# Altium schematic sheet tia.SchDoc: DiPho AFE
size 420 x 297 mm; Author: P. Daniel; DrawnBy: P. Daniel; Address1: WUT ISE; Address2: WUT ISE; Address3: piotrmaciejdaniel@gmail.com; SheetNumber: 2; SheetTotal: 4; ModifiedBy: -; CreateDate: 10-12.2021; CheckedDate: -; Title2: PG TIA schematic; Designer: Piotr Daniel
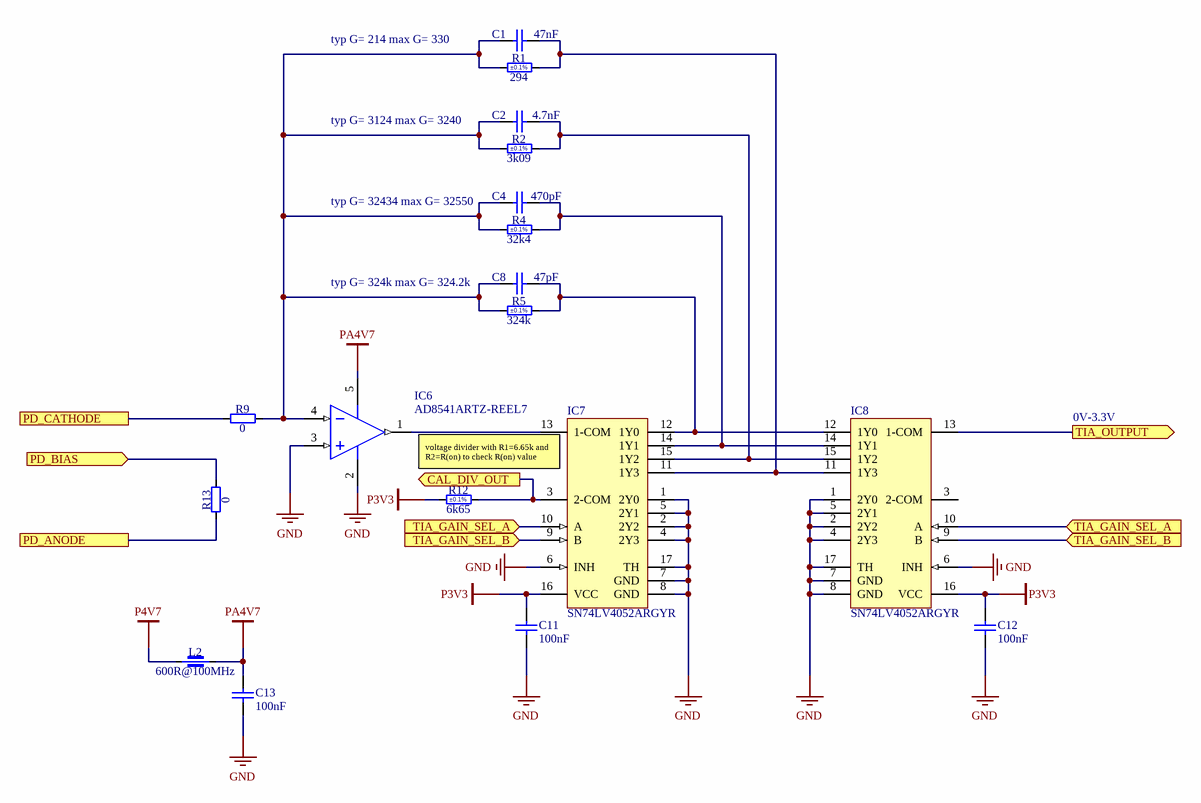
[diagram p0: tia.SchDoc]

## Parts
C1  47nF  [CAPC1005X55N]
C2  4.7nF  [CAPC1005X55N]
C4  470pF  [CAPC1005X55N]
C8  47pF  [CAPC1005X55N]
C11  100nF  [CAPC1005X55N]
C12  100nF  [CAPC1005X55N]
C13  100nF  [CAPC1005X55N]
IC6  AD8541ARTZ-REEL7  [ADI-RJ-5_N]
IC7  SN74LV4052ARGYR  [FP-RGY0016A-MFG]
IC8  SN74LV4052ARGYR  [FP-RGY0016A-MFG]
L2  600R@100MHz  [INDC1005X55N]
R1  294  Tolerance: ±0.1%  [RESC1005X40N]
R2  3k09  Tolerance: ±0.1%  [RESC1005X40N]
R4  32k4  Tolerance: ±0.1%  [RESC1005X40N]
R5  324k  Tolerance: ±0.1%  [RESC1005X40N]
R9  0  [RESC1005X40N]
R12  6k65  Tolerance: ±0.1%  [RESC1005X40N]
R13  0  [RESC1005X40N]

## Ports
CAL_DIV_OUT (out), PD_ANODE, PD_BIAS (in), PD_CATHODE, TIA_GAIN_SEL_A (in), TIA_GAIN_SEL_B (in), TIA_OUTPUT (out)

## Nets
GND: C11.1 C12.1 C13.1 IC6.2(-V) IC6.3(+IN_A) IC7.1(2Y0) IC7.2(2Y2) IC7.4(2Y3) IC7.5(2Y1) IC7.6(INH) IC7.7(GND) IC7.8(GND) IC7.17(TH) IC8.1(2Y0) IC8.2(2Y2) IC8.4(2Y3) IC8.5(2Y1) IC8.6(INH) IC8.7(GND) IC8.8(GND) IC8.17(TH)
P3V3: C11.2 C12.2 IC7.16(VCC) IC8.16(VCC) R12.1
P4V7: L2.1
PA4V7: C13.2 IC6.5(+V) L2.2
CAL_DIV_OUT: IC7.3(2-COM) R12.2 ; port CAL_DIV_OUT
PD_ANODE: R13.1 ; port PD_ANODE
PD_BIAS: R13.2 ; port PD_BIAS
PD_CATHODE: R9.1 ; port PD_CATHODE
TIA_GAIN_SEL_A: IC7.10(A) IC8.10(A) ; port TIA_GAIN_SEL_A
TIA_GAIN_SEL_B: IC7.9(B) IC8.9(B) ; port TIA_GAIN_SEL_B
TIA_OUTPUT: IC8.13(1-COM) ; port TIA_OUTPUT
NetC1_1: C1.1 C2.1 C4.1 C8.1 IC6.4(-IN_A) R1.1 R2.1 R4.1 R5.1 R9.2
NetC1_2: C1.2 IC7.11(1Y3) IC8.11(1Y3) R1.2
NetC2_2: C2.2 IC7.15(1Y2) IC8.15(1Y2) R2.2
NetC4_2: C4.2 IC7.14(1Y1) IC8.14(1Y1) R4.2
NetC8_2: C8.2 IC7.12(1Y0) IC8.12(1Y0) R5.2
NetIC6_1: IC6.1(OUT_A) IC7.13(1-COM)

Not connected (* = marked no-connect by the designer): IC8 3(2-COM)

## Notes on the sheet
- typ G= 214 max G= 330
- typ G= 3124 max G= 3240
- typ G= 32434 max G= 32550
- typ G= 324k max G= 324.2k
- 0V-3.3V
- (near IC7) voltage divider with R1=6.65k and R2=R(on) to check R(on) value
- Project/Equipment
- Document
- Designer
- Drawn by
- Check.by
- Copyright WUT ISE 2021.
  This documentation describes Open Hardware and is licensed under the CERN OHL v.1.1. You may redistribute and modify this documentation under the terms of the CERN OHL v.1.1. (http://ohwr.org/CERNOHL). This documentation is distributed WITHOUT ANY EXPRESS OR IMPLIED WARRANTY, INCLUDING OF MERCHANTABILITY, SATISFACTORY QUALITY AND FITNESS FOR A PARTICULAR PURPOSE. Please see the CERN OHL v.1.1 for applicable conditions.
- Contact
- File
- Last Mod.
- Print Date
- Sheet
- Size
- A3
- of
- Rev

## Library data of the parts
C1 = CC0402_47NF_16V_10%_X7R: Non-polarised capacitor; Part Description: SMD Multilayer Chip Ceramic Capacitor; Manufacturer: GENERIC; Manufacturer1 Part Number: 223878715645; Voltage: 16V; TC: X7R; Tolerance: ±10%; Part Number: CC0402_47NF_16V_10%_X7R; Component Kind: Standard; Component Type: Standard; Pin Count: 2; Value: 47nF; Status: Not Recommended; Manufacturer Part Number: CC0402_47NF_16V_10%_X7R; Case: 0402; Mounted: Yes; Socket: No; SMD: Yes; Sense: No; Manufacturer1 Example: PHYCOMP; Manufacturer1 ComponentHeight: 0.55mm; HelpURL: \\cern.ch\dfs\Applications\Altium\Datasheets\CC0402_X7R_PHYCOMP.pdf; Author: CERN DEM JLC; CreateDate: 03.12.2007; LatestRevisionDate: 03.12.2007
C2 = CC0402_4.7NF_16V_10%_X7R: Non-polarised capacitor; Part Description: SMD Multilayer Chip Ceramic Capacitor; Manufacturer: GENERIC; Manufacturer1 Part Number: 223878715632; Voltage: 16V; TC: X7R; Tolerance: ±10%; Part Number: CC0402_4.7NF_16V_10%_X7R; Component Kind: Standard; Component Type: Standard; Pin Count: 2; Value: 4.7nF; Status: Not Recommended; Manufacturer Part Number: CC0402_4.7NF_16V_10%_X7R; Case: 0402; Mounted: Yes; Socket: No; SMD: Yes; Sense: No; Manufacturer1 Example: PHYCOMP; Manufacturer1 ComponentHeight: 0.55mm; HelpURL: \\cern.ch\dfs\Applications\Altium\Datasheets\CC0402_X7R_PHYCOMP.pdf; Author: CERN DEM JLC; CreateDate: 03.12.2007; LatestRevisionDate: 03.12.2007
C4 = CC0402_470PF_50V_10%_X7R: Non-polarised capacitor; Part Description: SMD Multilayer Chip Ceramic Capacitor; Manufacturer: GENERIC; Manufacturer1 Part Number: 223858715618; Voltage: 50V; TC: X7R; Tolerance: ±10%; Part Number: CC0402_470PF_50V_10%_X7R; Component Kind: Standard; Component Type: Standard; Pin Count: 2; Value: 470pF; Status: Not Recommended; Manufacturer Part Number: CC0402_470PF_50V_10%_X7R; Case: 0402; Mounted: Yes; Socket: No; SMD: Yes; Sense: No; Manufacturer1 Example: PHYCOMP; Manufacturer1 ComponentHeight: 0.55mm; HelpURL: \\cern.ch\dfs\Applications\Altium\Datasheets\CC0402_NP0_PHYCOMP.pdf; Author: CERN DEM JLC; CreateDate: 03.12.2007; LatestRevisionDate: 03.12.2007
C8 = CC0402_47PF_50V_5%_C0G: Non-polarised capacitor; Part Description: SMD Multilayer Chip Ceramic Capacitor; Manufacturer: GENERIC; Manufacturer1 Part Number: C0402C470J5GACTU; Voltage: 50V; TC: C0G/NP0; Tolerance: ±5%; Part Number: CC0402_47PF_50V_5%_C0G; Component Kind: Standard; Component Type: Standard; Pin Count: 2; Value: 47pF; Status: Preferred; Manufacturer Part Number: CC0402_47PF_50V_5%_C0G; Case: 0402; Mounted: Yes; Socket: No; SMD: Yes; Sense: No; Manufacturer1 Example: KEMET; Manufacturer1 ComponentHeight: 0.55mm; HelpURL: \\cern.ch\dfs\Applications\Altium\Datasheets\CC0402_C0G_KEMET_(Commercial Grade).pdf; Author: CERN DEM JLC; CreateDate: 03.12.2007; LatestRevisionDate: 22.04.2015
C11-C13 = CC0402_100NF_16V_10%_X7R: Non-polarised capacitor; Manufacturer: GENERIC; Part Description: SMD Multilayer Chip Ceramic Capacitor; Manufacturer1 Part Number: GRM155R71C104KA88D; Tolerance: ±10%; Voltage: 16V; TC: X7R; Part Number: CC0402_100NF_16V_10%_X7R; Component Kind: Standard; Component Type: Standard; Pin Count: 2; Value: 100nF; Status: Not Recommended; Manufacturer Part Number: CC0402_100NF_16V_10%_X7R; Case: 0402; Mounted: Yes; Socket: No; SMD: Yes; Sense: No; Manufacturer1 Example: MURATA; Manufacturer1 ComponentHeight: 0.55mm; HelpURL: \\cern.ch\dfs\Applications\Altium\Datasheets\CC0402_X7R_MURATA_GRM.pdf; Author: CERN DEM JLC; CreateDate: 05.12.2013; LatestRevisionDate: 03.12.2007
IC6 = CMP-0384-01498-2: Single Channel RRIO Operational Amplifier, 1 MHz BW, 920 mV/us SR, Industrial, 5-pin SOT23 (RJ-5), Reel; Manufacturer: Analog Devices; Generic Part Number: AD8541; Input Bias Current: 4pA; V Span Max: 5.5V; Amplifiers Per Package: 1; Small Signal Bandwidth: 1MHz; Input Offset Voltage: 1mV; Iq/Amp: 65uA; V Span Min: 2.7V; ComponentLink1URL: http://www.analog.com/en/index.html; ComponentLink2URL: http://www.analog.com/static/imported-files/data_sheets/AD8541_8542_8544.pdf; ComponentLink3Description: Package Specification; ComponentLink3URL: http://www.analog.com/static/imported-files/packages/PKG_PDF/SOT-23(RJ)/RJ_5.pdf; Slew Rate: 920mV/us; Mounting Technology: Surface Mount; ComponentLink4URL: http://www.analog.com/en/all-operational-amplifiers-op-amps/operational-amplifiers-op-amps/ad8541/products/product.html#product-recommendations; DatasheetVersion: Rev. G; ComponentLink1Description: Manufacturer URL; PackageVersion: 121608-A; ComponentLink2Description: Datasheet; RevisionNote: Reference Circuit URL fixed; PartNumber: AD8541ARTZ-REEL7; PackageDescription: 5-Pin Small Outline Transistor Package, Body 2.9 x 1.6 mm, Pitch 0.95 mm; ComponentLink4Description: Reference Circuit; PackageReference: RJ-5; Code_JEDEC: MO-178-AA
IC7 IC8 = SN74LV4052ARGYR: IC MULTIPLEXER DUAL 4X1 16VQFN; Supply Type: Single; Number of Bits: 4; Turn-Off Delay Time: 28ns; Number of Outputs: 2; Supply Current: 20uA; Propagation Delay: 12ns; On-State Resistance: 100R; Max Supply Voltage: 5.5V; Min Supply Voltage: 2V; Polarity: Non-Inverting; Bandwidth: 50MHz; Throw Configuration: SP4T; Number of Inputs: 8; Nominal Supply Current: 20uA; Min Operating Temperature: -40°C; RoHS Compliant: Yes; Max Operating Temperature: 85°C; Number of Channels: 2; Lead Free: Lead Free; Operating Supply Current: 20uA; Mount: Surface Mount; Number of Pins: 16; Package Quantity: 3000; Logic Function: Multiplexer; Packaging: Tape and Reel; Case/Package: VQFN; Series: 74LV; Radiation Hardening: No; Weight: 0.001312oz; REACH SVHC: No SVHC; Turn-On Delay Time: 28ns; Number of Switches: 2; Number of Circuits: 2
L2 = IND0402_MURATA_BLM15HD601SN1: Part Description: SMD EMIFIL Suppression Chip Ferrite Bead; Manufacturer: MURATA; Manufacturer Part Number: BLM15HD601SN1D; Power: 300mA; Resistance: 0.85R; Tolerance: ±25%; Part Number: IND0402_MURATA_BLM15HD601SN1; Component Kind: Standard; Component Type: Standard; Pin Count: 2; Value: 600R@100MHz; Status: None; Case: 0402; Mounted: Yes; Socket: No; SMD: Yes; Sense: No; ComponentHeight: 0.55mm; HelpURL: \\cern.ch\dfs\Applications\Altium\Datasheets\IND0402_MURATA_BLM15H.pdf; Author: CERN DEM JLC; CreateDate: 28.02.2012; LatestRevisionDate: 25.10.2018
R1 R2 R4 R5 R12 = R0402_10K_1%_0.0625W_100PPM: Resistor - 1%; Part Description: General Purpose Thick Film Chip Resistor; Manufacturer: GENERIC; Manufacturer1 Part Number: 232270671003L; Value: 10k; TC: ±100ppm/°C; PressFit: No; Part Number: R0402_10K_1%_0.0625W_100PPM; Component Kind: Standard; Component Type: Standard; Pin Count: 2; Status: Not Recommended; Power: 0.0625W; Manufacturer Part Number: R0402_10K_1%_0.0625W_100PPM; Case: 0402; Mounted: Yes; Sense: No; Socket: No; SMD: Yes; Manufacturer1 Example: YAGEO PHYCOMP; Manufacturer1 ComponentHeight: 0.4mm; HelpURL: \\cern.ch\dfs\Applications\Altium\Datasheets\R0402_Phycomp_RC0402.pdf; Author: CERN DEM JLC; CreateDate: 03.12.2007; LatestRevisionDate: 17.10.2012
R9 R13 = R0402_0R_JUMPER: Resistor; Part Description: 1A (0.05R Max DC Resistance) Zero Ohm Jumper; Manufacturer: GENERIC; Manufacturer1 Part Number: 232270591001L; PressFit: No; Part Number: R0402_0R_JUMPER; Component Kind: Standard; Component Type: Standard; Pin Count: 2; Value: 0; Status: Not Recommended; Manufacturer Part Number: R0402_0R_JUMPER; Case: 0402; Mounted: Yes; Sense: No; Socket: No; SMD: Yes; Manufacturer1 Example: YAGEO PHYCOMP; Manufacturer1 ComponentHeight: 0.4mm; HelpURL: \\cern.ch\dfs\Applications\Altium\Datasheets\R0402_Phycomp_RC0402.pdf; Author: CERN DEM JLC; CreateDate: 03.12.2007; LatestRevisionDate: 17.10.2012